# EAGLE design USB_HUB (EAGLE 8.6.1)
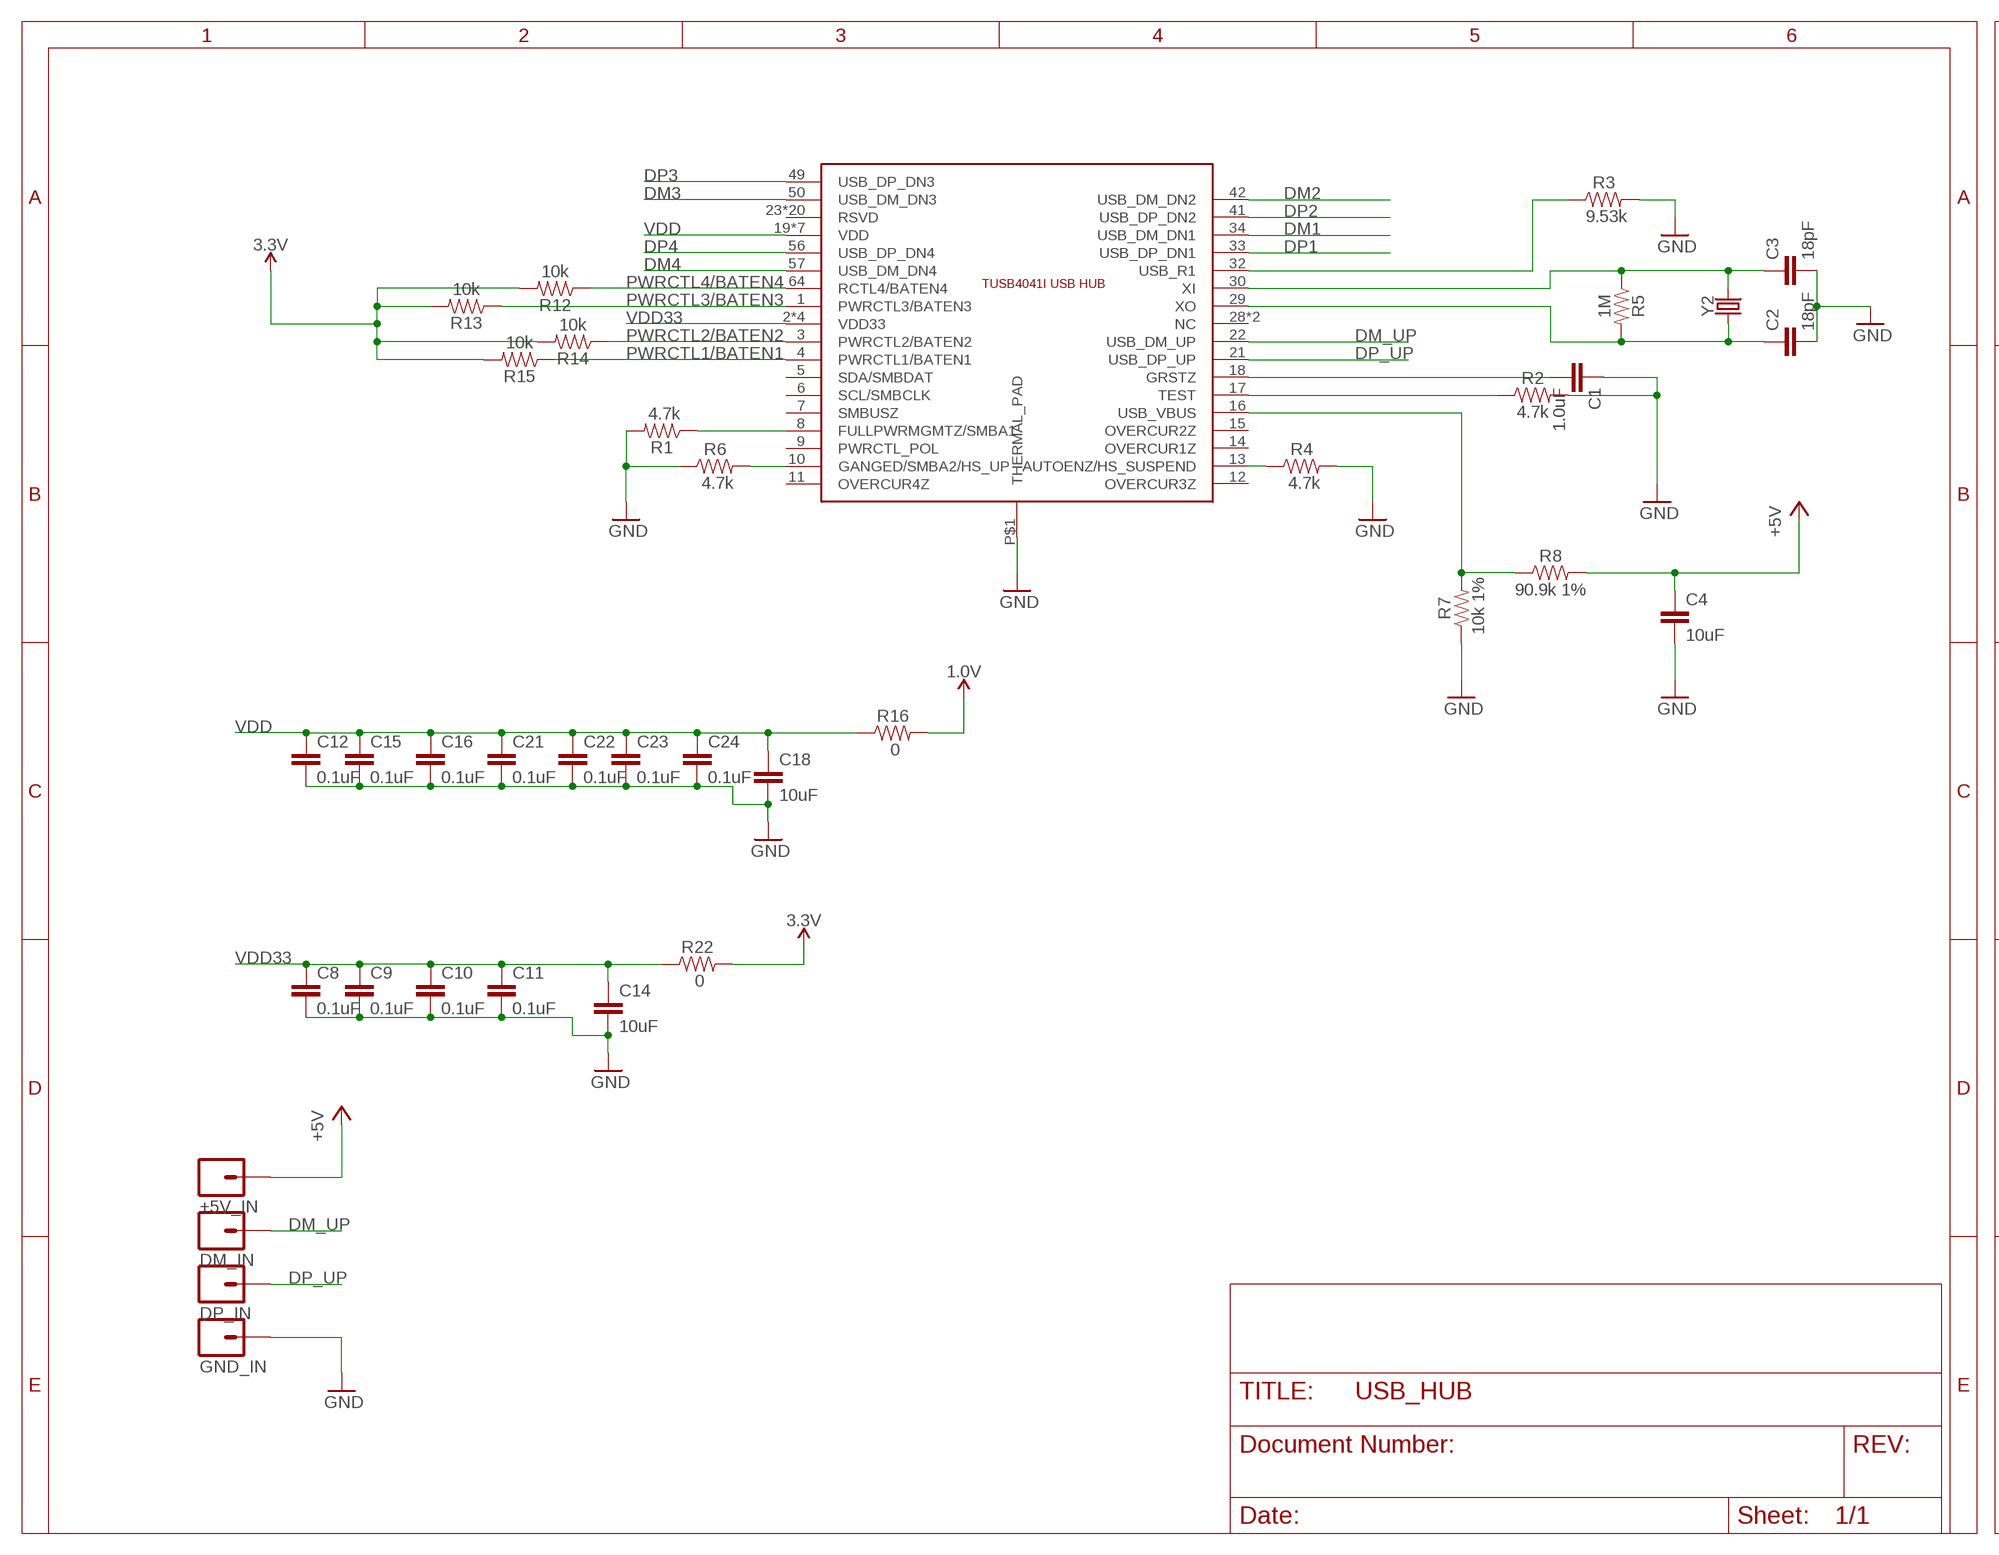
[diagram p0: schematic, sheet 1, part 1 of 2]
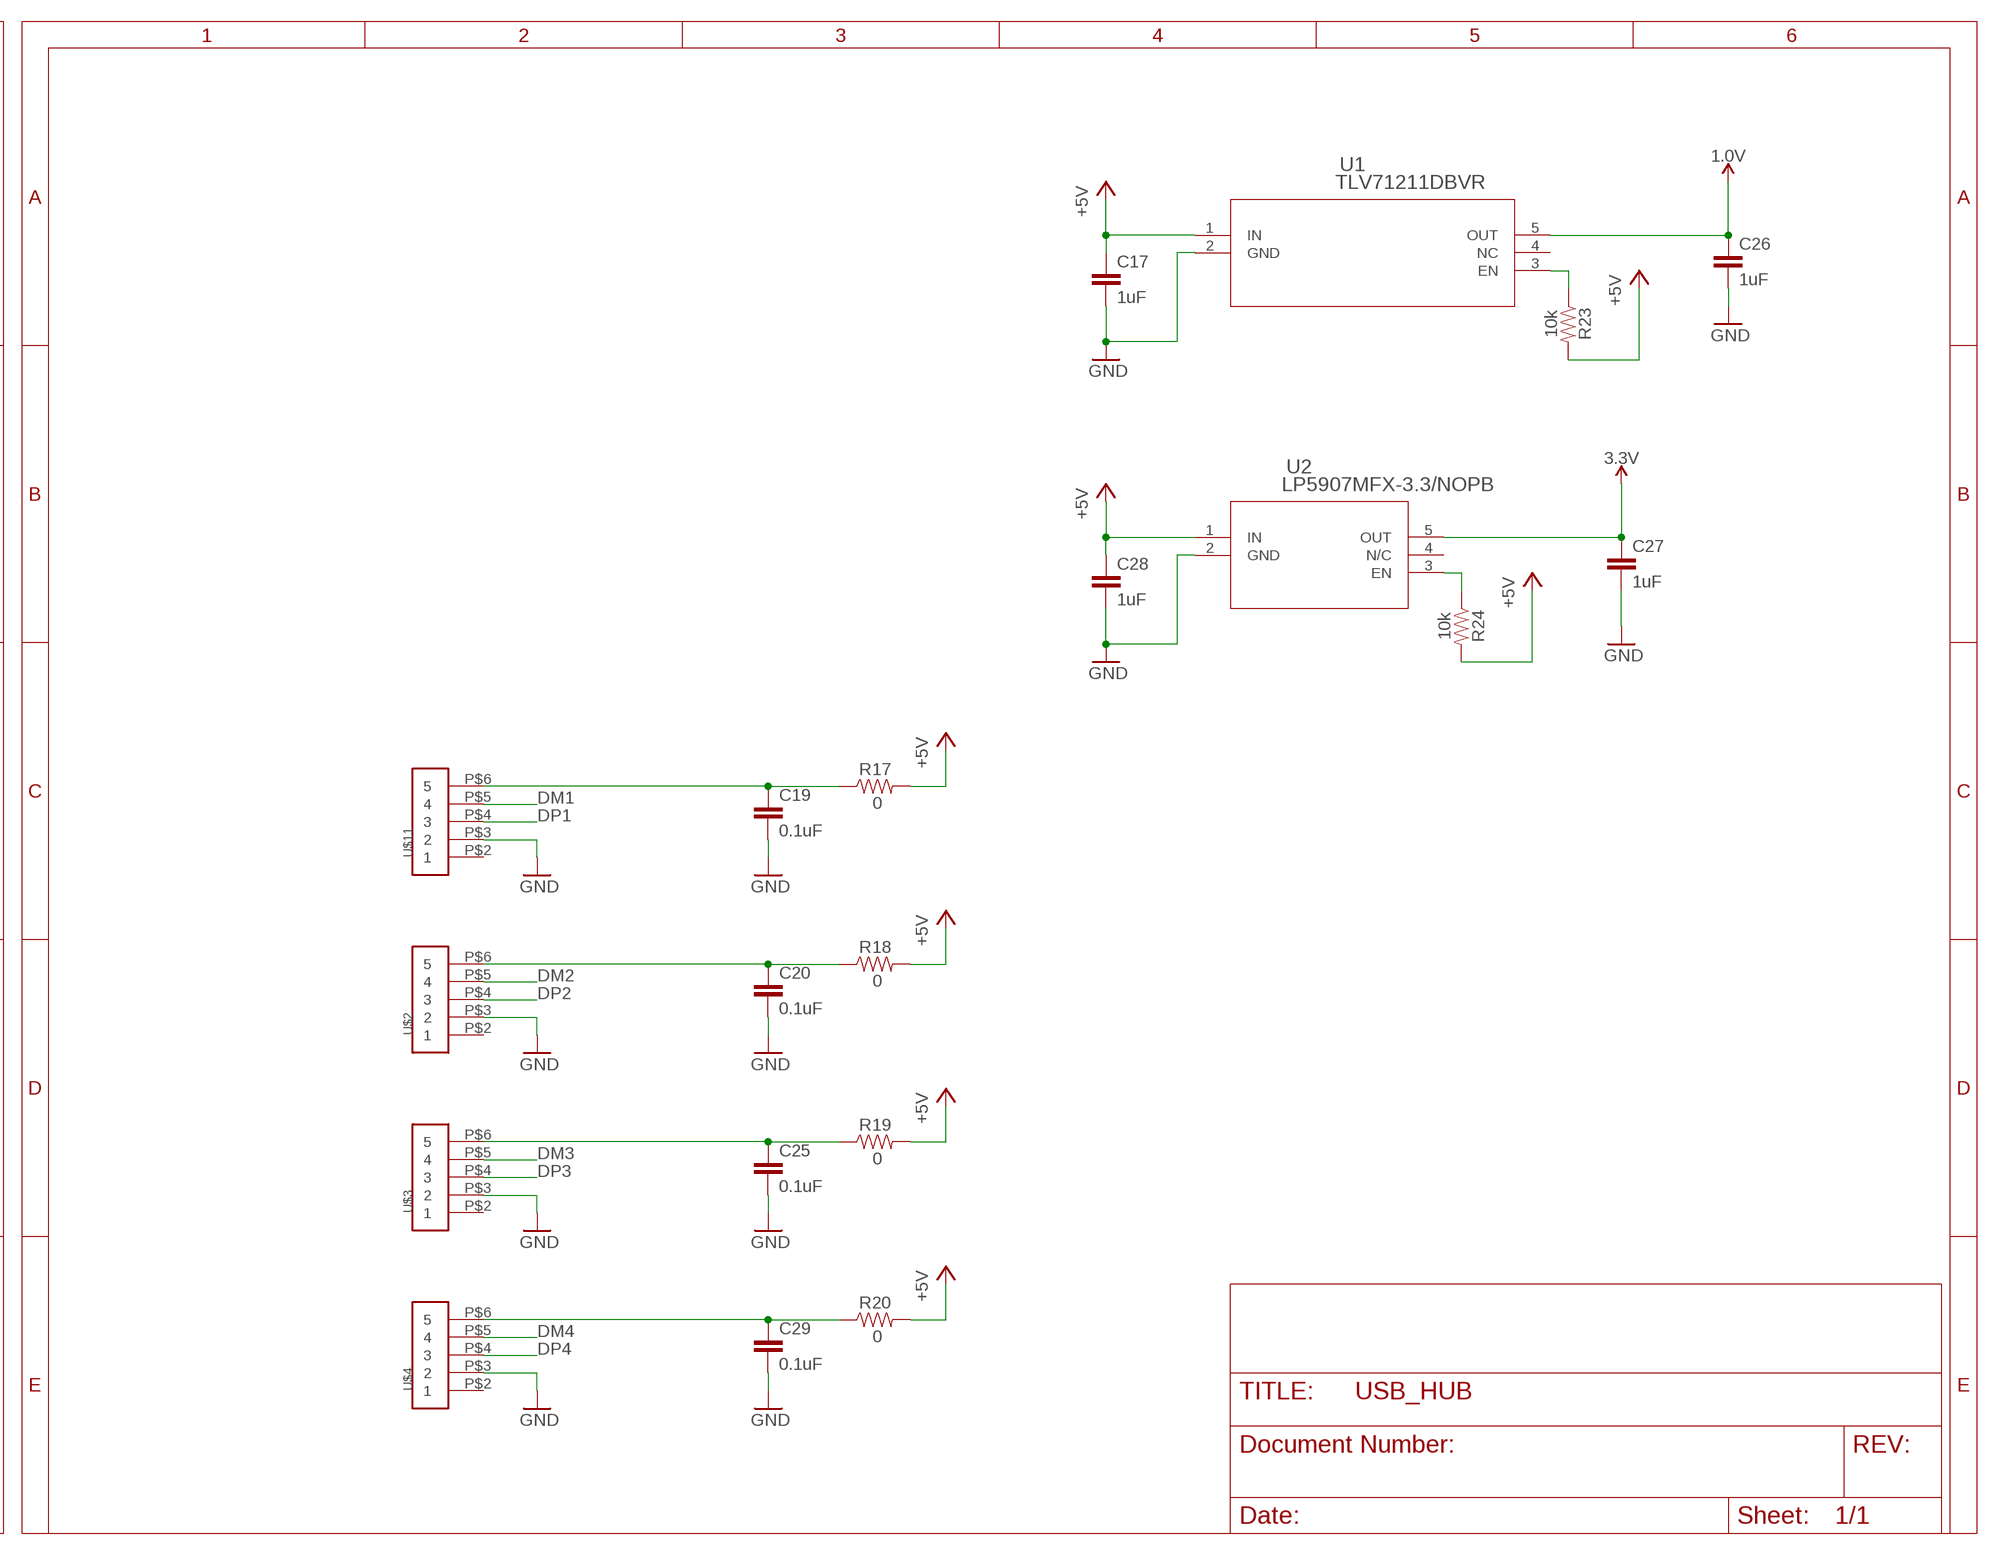
[diagram p1: schematic, sheet 1, part 2 of 2]

## Parts
+5V_IN  M01PTH  [1X01]
C1  1.0uF  1.0UF-0603-16V-10%  [0603]
C2  18pF  18PF-0603-50V-5%  [0603]
C3  18pF  18PF-0603-50V-5%  [0603]
C4  10uF  10UF-0805-10V-10%  [0805]
C8  0.1uF  0.1UF-0603-25V-(+80/-20%)  [0603]
C9  0.1uF  0.1UF-0603-25V-(+80/-20%)  [0603]
C10  0.1uF  0.1UF-0603-25V-(+80/-20%)  [0603]
C11  0.1uF  0.1UF-0603-25V-(+80/-20%)  [0603]
C12  0.1uF  0.1UF-0603-25V-(+80/-20%)  [0603]
C14  10uF  10UF-0805-10V-10%  [0805]
C15  0.1uF  0.1UF-0603-25V-(+80/-20%)  [0603]
C16  0.1uF  0.1UF-0603-25V-(+80/-20%)  [0603]
C17  1uF  0.1UF-0603-25V-(+80/-20%)  [0603]
C18  10uF  10UF-0805-10V-10%  [0805]
C19  0.1uF  0.1UF-0603-25V-(+80/-20%)  [0603]
C20  0.1uF  0.1UF-0603-25V-(+80/-20%)  [0603]
C21  0.1uF  0.1UF-0603-25V-(+80/-20%)  [0603]
C22  0.1uF  0.1UF-0603-25V-(+80/-20%)  [0603]
C23  0.1uF  0.1UF-0603-25V-(+80/-20%)  [0603]
C24  0.1uF  0.1UF-0603-25V-(+80/-20%)  [0603]
C25  0.1uF  0.1UF-0603-25V-(+80/-20%)  [0603]
C26  1uF  0.1UF-0603-25V-(+80/-20%)  [0603]
C27  1uF  0.1UF-0603-25V-(+80/-20%)  [0603]
C28  1uF  0.1UF-0603-25V-(+80/-20%)  [0603]
C29  0.1uF  0.1UF-0603-25V-(+80/-20%)  [0603]
DM_IN  M01PTH  [1X01]
DP_IN  M01PTH  [1X01]
GND_IN  M01PTH  [1X01]
R1  4.7k  RESISTOR0603  [0603]
R2  4.7k  4.7KOHM-0603-1/10W-1%  [0603]
R3  9.53k  RESISTOR0603  [0603]
R4  4.7k  RESISTOR0603  [0603]
R5  1M  4.7KOHM-0603-1/10W-1%  [0603]
R6  4.7k  RESISTOR0603  [0603]
R7  10k 1%  RESISTOR0603  [0603]
R8  90.9k 1%  RESISTOR0603  [0603]
R12  10k  RESISTOR0603  [0603]
R13  10k  RESISTOR0603  [0603]
R14  10k  RESISTOR0603  [0603]
R15  10k  RESISTOR0603  [0603]
R16  0  RESISTOR0805  [0805]
R17  0  RESISTOR0805  [0805]
R18  0  RESISTOR0805  [0805]
R19  0  RESISTOR0805  [0805]
R20  0  RESISTOR0805  [0805]
R22  0  RESISTOR0805  [0805]
R23  10k  RESISTOR0603  [0603]
R24  10k  RESISTOR0603  [0603]
U1  TLV71211DBVR  [DBV5]
U2  LP5907MFX-3.3/NOPB  [DBV5]
U$1  TUSB4041I  [TUSB4041I]
U$2  T2I5P  [T2I5P]
U$3  T2I5P  [T2I5P]
U$4  T2I5P  [T2I5P]
U$11  T2I5P  [T2I5P]
Y2  CRYSTALPTH-HC49US  [HC49US]

## Nets
1.0V: C26.1 R16.2 U1.5(OUT)
3.3V: C27.1 R12.2 R13.2 R14.2 R15.2 R22.2 U2.5(OUT)
+5V: +5V_IN.1 C4.1 C17.1 C28.1 R8.2 R17.2 R18.2 R19.2 R20.2 R23.2 R24.2 U1.1(IN) U2.1(IN)
DM1: U$1.34(USB_DM_DN1) U$11.P$5
DM2: U$1.42(USB_DM_DN2) U$2.P$5
DM3: U$1.50(USB_DM_DN3) U$3.P$5
DM4: U$1.57(USB_DM_DN4) U$4.P$5
DM_UP: DM_IN.1 U$1.22(USB_DM_UP)
DP1: U$1.33(USB_DP_DN1) U$11.P$4
DP2: U$1.41(USB_DP_DN2) U$2.P$4
DP3: U$1.49(USB_DP_DN3) U$3.P$4
DP4: U$1.56(USB_DP_DN4) U$4.P$4
DP_UP: DP_IN.1 U$1.21(USB_DP_UP)
GND: C1.1 C2.2 C3.2 C4.2 C8.2 C9.2 C10.2 C11.2 C12.2 C14.2 C15.2 C16.2 C17.2 C18.2 C19.2 C20.2 C21.2 C22.2 C23.2 C24.2 C25.2 C26.2 C27.2 C28.2 C29.2 GND_IN.1 R1.2 R2.2 R3.2 R4.2 R6.1 R7.1 U1.2(GND) U2.2(GND) U$1.P$1(THERMAL_PAD) U$2.P$3 U$3.P$3 U$4.P$3 U$11.P$3
N$1: C1.2 U$1.18(GRSTZ)
N$2: R3.1 U$1.32(USB_R1)
N$3: R2.1 U$1.17(TEST)
N$4: R4.1 U$1.13(AUTOENZ/HS_SUSPEND)
N$5: C3.1 R5.1 U$1.30(XI) Y2.2
N$6: C2.1 R5.2 U$1.29(XO) Y2.1
N$7: R1.1 U$1.8(FULLPWRMGMTZ/SMBA1)
N$8: R6.2 U$1.10(GANGED/SMBA2/HS_UP)
N$9: R7.2 R8.1 U$1.16(USB_VBUS)
N$10: R23.1 U1.3(EN)
N$18: R24.1 U2.3(EN)
PWRCTL1/BATEN1: R15.1 U$1.4(PWRCTL1/BATEN1)
PWRCTL2/BATEN2: R14.1 U$1.3(PWRCTL2/BATEN2)
PWRCTL3/BATEN3: R13.1 U$1.1(PWRCTL3/BATEN3)
PWRCTL4/BATEN4: R12.1 U$1.64(RCTL4/BATEN4)
USB1_+5V: C19.1 R17.1 U$11.P$6
USB2_+5V: C20.1 R18.1 U$2.P$6
USB3_+5V: C25.1 R19.1 U$3.P$6
USB4_+5V: C29.1 R20.1 U$4.P$6
VDD: C12.1 C15.1 C16.1 C18.1 C21.1 C22.1 C23.1 C24.1 R16.1 U$1.19(VDD) U$1.25(VDD) U$1.37(VDD) U$1.45(VDD) U$1.53(VDD) U$1.60(VDD) U$1.63(VDD)
VDD33: C8.1 C9.1 C10.1 C11.1 C14.1 R22.1 U$1.2(VDD33) U$1.20(VDD33) U$1.31(VDD33) U$1.48(VDD33)
Unconnected: U1.4(NC) U2.4(N/C) U$1.5(SDA/SMBDAT) U$1.6(SCL/SMBCLK) U$1.7(SMBUSZ) U$1.9(PWRCTL_POL) U$1.11(OVERCUR4Z) U$1.12(OVERCUR3Z) U$1.14(OVERCUR1Z) U$1.15(OVERCUR2Z) U$1.23(RSVD) U$1.24(RSVD) U$1.26(RSVD) U$1.27(RSVD) U$1.28(NC) U$1.35(RSVD) U$1.36(RSVD) U$1.38(RSVD) U$1.39(RSVD) U$1.40(NC) U$1.43(RSVD) U$1.44(RSVD) U$1.46(RSVD) U$1.47(RSVD) U$1.51(RSVD) U$1.52(RSVD) U$1.54(RSVD) U$1.55(RSVD) U$1.58(RSVD) U$1.59(RSVD) U$1.61(RSVD) U$1.62(RSVD) U$2.P$2 U$3.P$2 U$4.P$2 U$11.P$2

## Library data of the parts
+5V_IN DM_IN DP_IN GND_IN = SparkFun-Connectors:M01: Header 1 Standard 1-pin 0.1" header. Use with straight break away headers (SKU : PRT-00116), right angle break away headers (PRT-00553), swiss pins (PRT-00743), machine pins (PRT-00117), and female headers (PRT-00115). SMTSO-256-ET is a "flush mount" nut for a 4-40 screw. The older package used to be too tight, and did not allow it to sit properly thru the drill hit. The latest (0.165DIA) fits nice and snug.
C1 = SparkFun-Capacitors:1.0UF: 1µF ceramic capacitors A capacitor is a passive two-terminal electrical component used to store electrical energy temporarily in an electric field.; PROD_ID: CAP-00868
C2 C3 = SparkFun-Capacitors:18PF: 18pF ceramic capacitors A capacitor is a passive two-terminal electrical component used to store electrical energy temporarily in an electric field.; PROD_ID: CAP-08267
C4 C14 C18 = SparkFun-Capacitors:10UF: 10.0µF ceramic capacitors A capacitor is a passive two-terminal electrical component used to store electrical energy temporarily in an electric field.; PROD_ID: CAP-11330
C8-C12 C15 C16 C19-C25 C29 = SparkFun-Capacitors:0.1UF: 0.1µF ceramic capacitors A capacitor is a passive two-terminal electrical component used to store electrical energy temporarily in an electric field.; PROD_ID: CAP-00810
C17 C26-C28 = SparkFun-Capacitors:0.1UF: 0.1µF ceramic capacitors A capacitor is a passive two-terminal electrical component used to store electrical energy temporarily in an electric field.; PROD_ID: CAP-00810; VALUE: 0.1uF
R1 R3 R4 R6-R8 R12-R20 R22-R24 = SparkFun-Resistors:RESISTOR: Generic Resistor Package
R2 = SparkFun-Resistors:4.7KOHM: 4.7kΩ resistor A resistor is a passive two-terminal electrical component that implements electrical resistance as a circuit element. Resistors act to reduce current flow, and, at the same time, act to lower voltage levels within circuits. - Wikipedia; PROD_ID: RES-07857
R5 = SparkFun-Resistors:4.7KOHM: 4.7kΩ resistor A resistor is a passive two-terminal electrical component that implements electrical resistance as a circuit element. Resistors act to reduce current flow, and, at the same time, act to lower voltage levels within circuits. - Wikipedia; PROD_ID: RES-07857; VALUE: 4.7k
U1 = TLV71211DBVR:TLV71211DBVR; MANUFACTURER_PART_NUMBER: TLV71211DBVR; VENDOR: TEXAS INSTRUMENTS
U2 = LP5907MFX:LP5907MFX-3.3/NOPB; MANUFACTURER_PART_NUMBER: LP5907MFX3.3NOPB; VENDOR: Texas Instruments
U$1 = TUSB4041I:TUSB4041I
U$2-U$4 U$11 = BackplaneParts:T2I5P
Y2 = SparkFun-Clocks:CRYSTAL: Crystals (Generic) These are passive quartz crystals, which can be used as a clock source for a microcontroller. Crystal's are two-terminal devices. They require external "load" capacitors to generate an oscillating signal.

## Board
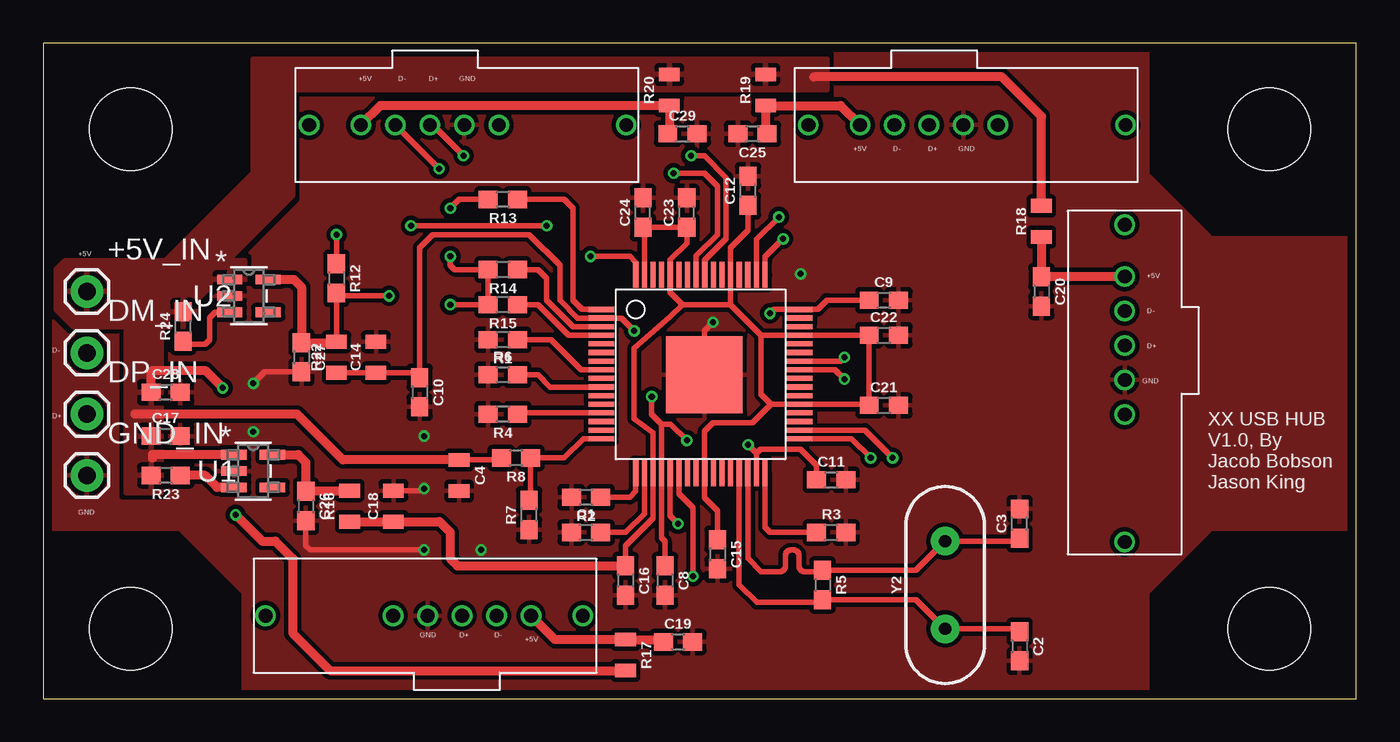
[diagram p2: board, top side]
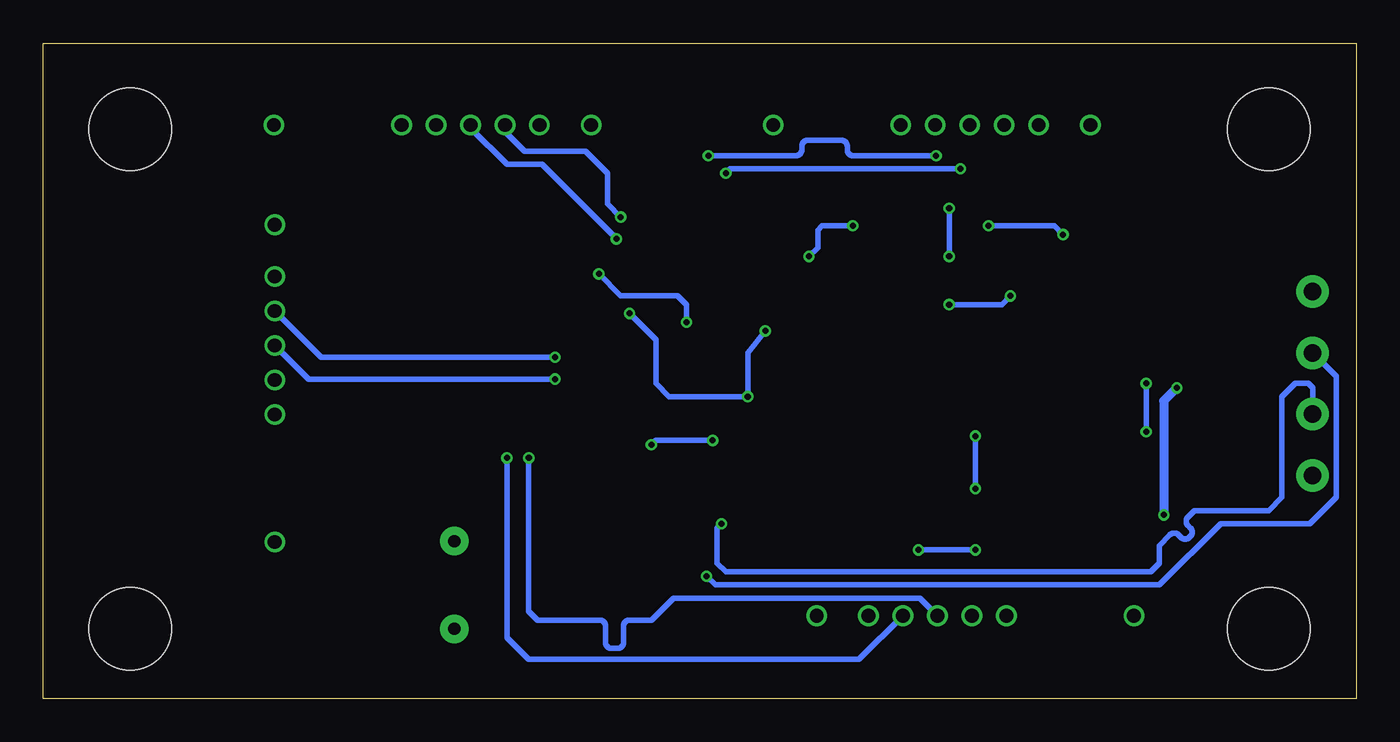
[diagram p3: board, bottom side, seen from below]

Size 76.18 x 38.02 mm. Coordinates in mm from the lower left corner, seen from the top.
Outline: 0,0 76.18,0 76.18,38.02 0,38.02 0,0
Copper layers (1*16): Top 0.035mm / dielectric 1.6mm / Bottom 0.035mm
Design rules "Elecrow_2-layer_PCB_eagle_rule": minimum track width 6mil, minimum drill 12mil, track to track 6mil, track to pad 6mil, pad to pad 6mil, via to via 8mil, smd to smd 0mil, copper to edge 20mil, drill to drill 10mil, minimum pad ring 6mil, minimum via ring 6mil, stop-mask expansion 0mil, vias tented up to drill 100mil, thermal gap 10mil
Holes 4.76 mm at 5.08,4.06 5.08,33.02 71.12,4.06 71.12,33.02

### Footprints (pad centres in the part's own frame; a part is rotated, then mirrored left to right if it is on the bottom)
1X01 = drill 1.016 pad 1.88: 1 0,0
0603 = smd 1.1 x 1: 1 -0.85,0; 2 0.85,0
0805 = smd 0.8 x 1.2: 1 -0.9,0; 2 0.9,0
DBV5 = smd 1.473 x 0.559: 1 -1.118,0.95; 2 -1.118,0; 3 -1.118,-0.95; 4 1.118,-0.95; 5 1.118,0.95
TUSB4041I = smd 0.3 x 1.5: 1 -1.5,-7.5; 2 -1,-7.5; 3 -0.5,-7.5; 4 0,-7.5; 5 0.5,-7.5; 6 1,-7.5; 7 1.5,-7.5; 8 2,-7.5; 9 2.5,-7.5; 10 3,-7.5; 11 3.5,-7.5; 12 4,-7.5; 13 4.5,-7.5; 14 5,-7.5; 15 5.5,-7.5; 16 6,-7.5; 33 6,4; 34 5.5,4; 35 5,4; 36 4.5,4; 37 4,4; 38 3.5,4; 39 3,4; 40 2.5,4; 41 2,4; 42 1.5,4; 43 1,4; 44 0.5,4; 45 0,4; 46 -0.5,4; 47 -1,4; 48 -1.5,4 | smd 1.5 x 0.3: 17 8,-5.5; 18 8,-5; 19 8,-4.5; 20 8,-4; 21 8,-3.5; 22 8,-3; 23 8,-2.5; 24 8,-2; 25 8,-1.5; 26 8,-1; 27 8,-0.5; 28 8,0; 29 8,0.5; 30 8,1; 31 8,1.5; 32 8,2; 49 -3.5,2; 50 -3.5,1.5; 51 -3.5,1; 52 -3.5,0.5; 53 -3.5,0; 54 -3.5,-0.5; 55 -3.5,-1; 56 -3.5,-1.5; 57 -3.5,-2; 58 -3.5,-2.5; 59 -3.5,-3; 60 -3.5,-3.5; 61 -3.5,-4; 62 -3.5,-4.5; 63 -3.5,-5; 64 -3.5,-5.5 | smd 4.445 x 4.445: P$1 2.286,-1.524
T2I5P = drill 0.8: P$1 -19.1,3.3; P$2 -11.7,3.3; P$3 -9.7,3.3; P$4 -7.7,3.3; P$5 -5.7,3.3; P$6 -3.7,3.3; P$7 -0.7,3.3
HC49US = drill 0.7 pad 1.651: 1 -2.54,0; 2 2.54,0

### Placement (x,y rotation side)
+5V_IN  2.54,23.62 0 top
C1  31.5,9.65 0 top
C2  56.64,3.05 270 top
C3  56.64,10.16 90 top
C4  24.13,12.95 270 top
C8  36.07,6.86 270 top
C9  48.77,23.11 0 top
C10  21.84,17.78 270 top
C11  45.72,12.7 0 top
C12  40.89,29.46 90 top
C14  19.3,19.81 90 top
C15  39.12,8.38 270 top
C16  33.78,6.86 270 top
C17  7.11,15.24 0 top
C18  20.32,11.18 90 top
C19  36.83,3.3 0 top
C20  57.91,23.62 270 top
C21  48.77,17.02 0 top
C22  48.77,21.08 0 top
C23  37.34,28.19 90 top
C24  34.8,28.19 90 top
C25  41.15,32.77 180 top
C26  15.24,11.18 270 top
C27  14.99,19.81 270 top
C28  7.11,17.78 0 top
C29  37.08,32.77 0 top
DM_IN  2.54,20.07 0 top
DP_IN  2.54,16.51 0 top
GND_IN  2.54,12.95 0 top
R1  26.67,20.83 180 top
R2  31.5,11.68 180 top
R3  45.72,9.65 0 top
R4  26.67,16.51 180 top
R5  45.21,6.6 270 top
R6  26.67,18.8 0 top
R7  28.19,10.67 90 top
R8  27.43,13.97 180 top
R12  17.02,24.38 270 top
R13  26.67,28.96 180 top
R14  26.67,24.89 180 top
R15  26.67,22.86 180 top
R16  17.78,11.18 90 top
R17  33.78,2.54 270 top
R18  57.91,27.69 90 top
R19  41.91,35.31 90 top
R20  36.32,35.31 90 top
R22  17.02,19.81 90 top
R23  7.11,12.95 180 top
R24  8.13,21.59 90 top
U1  12.19,13.21 0 top
U2  11.94,23.37 0 top
U$1  39.88,21.08 270 top
U$2  66.04,28.19 90 top
U$3  43.69,36.58 180 top
U$4  14.73,36.58 180 top
U$11  32,1.52 0 top
Y2  52.32,6.6 90 top

### Tracks (layer width: path | path; a pad name or v marks a point on that pad's centre or on a via)
1.0V
  Top 0.508: U1.5 14.8,14.16 15.24,13.72 C26.1 15.29,12.08 R16.2
3.3V  (via drill 0.35)
  Top 0.305: R13.2 24.13,28.96 v23.62,28.45 | v23.62,25.65 23.62,25.15 23.88,24.89 R14.2 R15.2 v23.62,22.86 | R12.2 17.02,23.37 | 17.02,23.37 R22.2 | v20.07,23.37 17.02,23.37
  Top 0.508: U2.5 14.54,24.32 14.99,23.88 C27.1 16.97,20.66 R22.2
  Bottom 0.305: v23.62,28.45 v23.62,25.65 | v23.62,22.86 20.57,22.86 v20.07,23.37
+5V  (via drill 0.35)
  Top 0.305: C4.1 26.47,13.85 R8.2
  Top 0.508: U1.1 6.35,14.16 6.35,13.97 | C4.1 17.39,13.85 14.73,16.51 5.33,16.51 | C28.1 6.26,18.96 6.35,19.05 9.4,19.05 v10.41,18.03 | v11.18,10.67 12.7,9.14 13.46,9.14 14.48,8.13 14.48,3.81 16.65,1.64 R17.2 | R18.2 57.91,33.78 55.63,36.07 44.7,36.07
  Bottom 0.508: v10.41,18.03 11.18,17.27 v11.18,10.67
  pour Top: 8.89,21.59 1.78,21.59 0.76,22.61 0.76,24.89 1.27,25.4 11.68,25.4 11.68,24.13 9.91,24.13 8.89,23.11
  pour Top: 4.83,21.59 4.83,11.94 6.86,11.94 6.86,21.59
  pour Top: 7.11,25.4 12.19,30.48 12.19,37.08 45.47,37.08 45.47,35.31 14.48,35.31 14.48,29.21 10.67,25.4
DM1  (via drill 0.35)
  Top 0.305: U$1.34 47.66,15.58 v49.28,13.97
  Bottom 0.305: v49.28,13.97 49.28,3.56 48.01,2.29 28.84,2.29 U$11.P$5
DM2  (via drill 0.35)
  Top 0.305: U$1.42 46.25,19.58 v46.48,19.81
  Bottom 0.305: v46.48,19.81 60.06,19.81 U$2.P$5
DM3  (via drill 0.35)
  Top 0.305: U$1.50 41.38,26.65 v42.67,27.94
  Bottom 0.305: U$3.P$5 49.39,32.88 48.26,31.75 44.7,31.75 43.43,30.48 43.43,28.7 v42.67,27.94
DM4  (via drill 0.35)
  Top 0.305: U$1.57 37.88,25.69 39.12,26.92 39.12,29.72 38.35,30.48 v36.58,30.48 | v22.97,30.73 U$4.P$5
  Bottom 0.305: v22.97,30.73 36.32,30.73 v36.58,30.48
DM_UP  (via drill 0.35)
  Top 0.305: U$1.22 36.88,11.89 37.7,11.07 v37.7,7.11
  Bottom 0.305: DM_IN.1 1.17,18.69 1.17,11.68 2.69,10.16 7.87,10.16 11.43,6.6 37.19,6.6 v37.7,7.11
DP1  (via drill 0.35)
  Top 0.305: U$1.33 46.89,15.08 v48.01,13.97
  Bottom 0.305: U$11.P$4 25.32,5.84 39.62,5.84 40.89,4.57 42.16,4.57 arc-90 42.51,4.23 42.51,3.27 arc90 42.85,2.93 43.22,2.93 arc90 43.56,3.27 43.56,4.23 arc-90 43.91,4.57 47.5,4.57 48.01,5.08 v48.01,13.97
DP2  (via drill 0.35)
  Top 0.305: U$1.41 45.94,19.08 v46.48,18.54
  Bottom 0.305: v46.48,18.54 60.79,18.54 U$2.P$4
DP3  (via drill 0.35)
  Top 0.305: U$1.49 41.88,25.62 v42.93,26.67
  Bottom 0.305: v42.93,26.67 47.24,30.99 49.28,30.99 51.39,33.1 U$3.P$4
DP4  (via drill 0.35)
  Top 0.305: v24.38,31.5 22.6,33.28 U$4.P$4 | U$1.56 38.38,25.42 39.62,26.67 39.62,30.23 38.35,31.5 v37.59,31.5
  Bottom 0.305: v24.38,31.5 29.19,31.5 arc90 29.53,31.84 29.53,32.04 arc-90 29.88,32.39 31.83,32.39 arc-90 32.17,32.04 32.17,31.84 arc90 32.51,31.5 v37.59,31.5
DP_UP  (via drill 0.35)
  Top 0.305: v36.83,10.16 36.38,10.61 U$1.21
  Bottom 0.305: v36.83,10.16 37.08,9.91 37.08,7.87 36.58,7.37 11.94,7.37 11.43,7.87 11.43,8.89 10.81,9.51 arc90 10.32,9.51 10.17,9.36 arc-90 9.69,9.36 9.63,9.42 arc-90 9.63,9.91 9.78,10.06 arc90 9.78,10.54 9.4,10.92 5.08,10.92 4.32,11.68 4.32,17.53 3.56,18.29 2.79,18.29 2.54,18.03 DP_IN.1
GND  (via drill 0.35)
  Top 0.305: C18.2 21.98,12.08 v22.1,12.19 | C27.2 12.87,18.96 v12.19,18.29 | C26.2 15.24,8.89 15.49,8.64 v22.1,8.64 | U$1.P$1 38.35,21.34 v38.86,21.84
  Bottom 0.305: v22.1,12.19 v22.1,15.24 | v12.19,18.29 v12.19,15.49 | v22.1,8.64 v25.4,8.64 | v38.86,21.84 38.86,22.86 39.37,23.37 42.67,23.37 v43.94,24.64
  pour Top (isolate 0.254, rank 3): 0,0 0,38.1 76.2,38.1 76.2,0
N$1
  Top 0.305: U$1.18 34.88,10.75 33.78,9.65 C1.2
N$2
  Top 0.305: U$1.32 41.88,9.94 42.16,9.65 R3.1
N$3
  Top 0.305: U$1.17 34.38,12.03 34.04,11.68 R2.1
N$4
  Top 0.305: U$1.13 27.59,16.58 R4.1
N$5
  Top 0.305: C3.1 56.48,9.14 Y2.2 50.63,7.45 R5.1 45.12,7.37 44.2,7.37 arc-90 43.85,7.71 43.85,8.29 arc90 43.51,8.64 43.4,8.64 arc90 43.05,8.29 43.05,7.71 arc-90 42.71,7.37 41.66,7.37 40.88,8.14 U$1.30
N$6
  Top 0.305: C2.1 56.48,4.06 Y2.1 50.63,5.75 R5.2 45.05,5.59 41.4,5.59 40.38,6.61 U$1.29
N$7
  Top 0.305: U$1.8 31.21,19.08 29.46,20.83 R1.1
N$8
  Top 0.305: U$1.10 29.42,18.08 28.7,18.8 R6.2
N$9
  Top 0.305: U$1.16 31.34,15.08 30.23,13.97 R8.1 28.28,11.35 R7.2
N$10
  Top 0.508: U1.3 10.09,12.26 9.4,12.95 R23.1
N$11
  cutout Top: 0,9.65 7.87,9.65 10.92,6.6 11.43,6.1 11.43,0 0,0
N$16
  cutout Top: 76.2,9.65 67.82,9.65 64.26,6.1 64.26,0 76.2,0
N$18
  Top 0.305: U2.3 9.97,22.42 9.65,22.1 9.65,20.83 9.4,20.57 8.55,20.57 R24.1
N$19
  cutout Top: 0,26.92 7.87,26.92 11.43,30.48 11.43,38.1 0,38.1
N$20
  cutout Top: 64.26,38.1 64.26,30.48 67.82,26.92 76.2,26.92 76.2,38.1
PWRCTL1/BATEN1
  Top 0.305: U$1.4 30.48,21.08 28.7,22.86 R15.1
PWRCTL2/BATEN2
  Top 0.305: U$1.3 30.74,21.58 29.21,23.11 29.21,24.38 28.7,24.89 R14.1
PWRCTL3/BATEN3
  Top 0.305: U$1.1 31.27,22.58 30.73,23.11 30.73,28.45 30.23,28.96 R13.1
PWRCTL4/BATEN4  (via drill 0.35)
  Top 0.305: v31.75,25.65 34.04,25.65 34.38,25.31 U$1.64 | v17.02,26.92 R12.1 | v29.21,27.43 v21.34,27.43
  Bottom 0.305: v29.21,27.43 30.99,27.43 31.24,27.18 31.24,26.16 v31.75,25.65 | v21.34,27.43 17.53,27.43 v17.02,26.92
USB1_+5V
  Top 0.508: C19.1 35.84,3.44 R17.1 29.69,3.44 U$11.P$6
USB2_+5V
  Top 0.508: R18.1 C20.1 57.93,24.49 U$2.P$6
USB3_+5V
  Top 0.508: C25.1 41.91,32.85 R19.1 46.26,34.41 U$3.P$6
USB4_+5V
  Top 0.508: C29.1 36.32,32.85 R20.1 19.56,34.41 U$4.P$6
VDD
  Top 0.305: 39.88,22.86 U$1.53 39.88,26.16 40.89,27.18 C12.1 | 39.88,22.86 41.66,21.08 | 41.66,21.08 U$1.45 C22.1 C21.1 47.85,17.08 U$1.37 42.23,17.08 | 42.23,17.08 41.15,16 38.86,16 38.38,15.52 U$1.25 38.38,11.66 39.12,10.92 C15.1 | 41.66,21.08 41.66,17.65 42.23,17.08 | C16.1 33.78,8.89 35.38,10.49 U$1.19 35.38,15.42 34.29,16.26 34.29,20.32 36.38,22.15 37.08,22.86 | U$1.63 34.88,27.26 C24.1 C23.1 37.34,26.42 36.38,25.46 U$1.60 36.38,23.57 37.08,22.86 | 37.08,22.86 39.88,22.86
  Top 0.508: R16.1 C18.1 23,10.28 23.62,9.65 23.62,8.13 24.04,7.71 C16.1
VDD33  (via drill 0.35)
  Top 0.305: C9.1 45.47,23.11 44.93,22.58 U$1.48 42.39,22.58 v42.16,22.35 | R22.1 C14.1 21.56,18.91 C10.1 21.84,26.16 22.61,26.92 28.19,26.92 29.97,25.15 29.97,23.11 31,22.08 U$1.2 33.54,22.08 v34.29,21.34 | v35.31,17.53 35.31,16.51 35.88,15.94 | 35.88,15.94 U$1.20 35.88,9.33 36.07,9.14 C8.1 | U$1.31 41.38,14.25 | 41.38,14.25 v40.89,14.73 | v37.34,14.99 36.39,15.94 35.88,15.94 | 41.38,14.25 41.61,14.48 43.94,14.48 44.87,13.55 C11.1
  Bottom 0.305: v34.29,21.34 35.31,20.07 v35.31,17.53 39.88,17.53 40.64,18.29 40.64,20.83 v42.16,22.35 | v40.89,14.73 40.64,14.99 v37.34,14.99

### Text on the board
tPlace: +5V | D- | D+ | GND | +5V | D- | D+ | GND | +5V | +5V | D- | D- | D+ | GND | D+ | XX USB HUB / V1.0, By / Jacob Bobson / Jason King | GND | GND | D+ | D- | +5V